# Altium project VNA_BASE_AF.PrjPcb
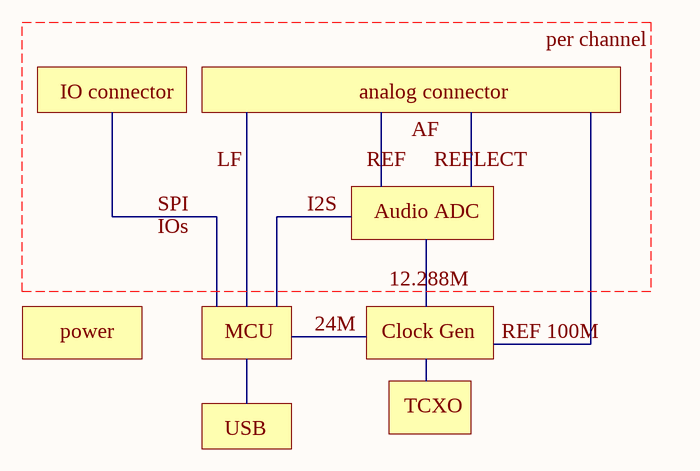
[diagram p0: block_diagram.SchDoc]
8 sheets, 89 parts. Net scope: flat (ports and power ports of the same name join across sheets).
Board file: VNA_BASE_AF.PcbDoc
Sheets:
  block_diagram.SchDoc
  AudioADCA.SchDoc
  AudioADCB.SchDoc
  clock.SchDoc
  MCU.SchDoc
  connectorA.SchDoc
  connectorB.SchDoc
  power.SchDoc

## Sheet block_diagram.SchDoc
size A4

### Notes on the sheet
- per channel
- IO connector
- LF
- analog connector
- REF
- AF
- REFLECT
- SPI
- IOs
- I2S
- Audio ADC
- 12.288M
- power
- MCU
- 24M
- Clock Gen
- REF 100M
- USB
- TCXO

## Sheet AudioADCA.SchDoc
size A4
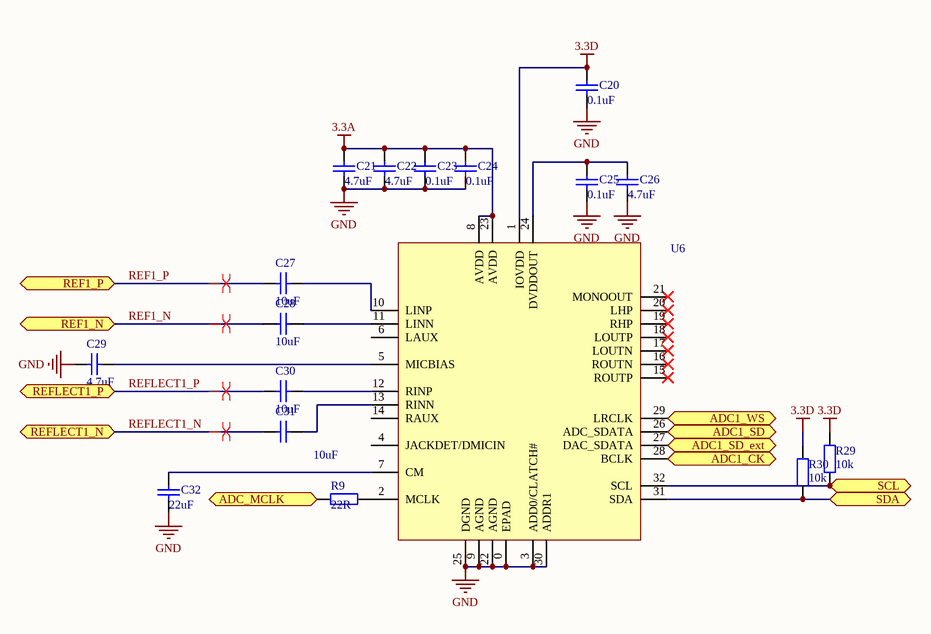
[diagram p1: AudioADCA.SchDoc]

### Parts
C20  0.1uF  [0402]
C21  4.7uF  [0805]
C22  4.7uF  [0805]
C23  0.1uF  [0402]
C24  0.1uF  [0402]
C25  0.1uF  [0402]
C26  4.7uF  [0805]
C27  10uF  [0402]
C28  10uF  [0402]
C29  4.7uF  [0402]
C30  10uF  [0402]
C31  10uF  [0402]
C32  22uF  [0805]
R9  22R  [0402]
R29  value 10k  [0402]  (hidden comment: Res2)
R30  value 10k  [0402]  (hidden comment: Res2)
U6  ADAU1761  [ADAU1761]  (value not drawn)

### Ports
ADC1_CK, ADC1_SD, ADC1_SD_ext, ADC1_WS, ADC_MCLK, REF1_N, REF1_P, REFLECT1_N, REFLECT1_P, SCL, SDA

### Nets
3.3A: C21.2 C22.2 C23.2 C24.2 U6.8(AVDD) U6.23(AVDD)
3.3D: C20.2 R29.2 R30.2 U6.1(IOVDD)
GND: C20.1 C21.1 C22.1 C23.1 C24.1 C25.1 C26.1 C29.1 C32.1 U6.0(EPAD) U6.3(ADD0/CLATCH#) U6.9(AGND) U6.22(AGND) U6.25(DGND) U6.30(ADDR1)
REF1_N: C28.2 ; port REF1_N
REF1_P: C27.2 ; port REF1_P
REFLECT1_N: C31.1 ; port REFLECT1_N
REFLECT1_P: C30.1 ; port REFLECT1_P
NetC25_2: C25.2 C26.2 U6.24(DVDDOUT)
NetC27_1: C27.1 U6.10(LINP)
NetC28_1: C28.1 U6.11(LINN)
NetC29_2: C29.2 U6.5(MICBIAS)
NetC30_2: C30.2 U6.12(RINP)
NetC31_2: C31.2 U6.13(RINN)
NetC32_2: C32.2 U6.7(CM)
NetR8_2: R9.2 ; port ADC_MCLK
NetR9_1: R9.1 U6.2(MCLK)
NetR11_2: R30.1 U6.31(SDA) ; port SDA
NetR12_2: R29.1 U6.32(SCL) ; port SCL
NetR16_1: U6.29(LRCLK) ; port ADC1_WS
NetR16_2: U6.28(BCLK) ; port ADC1_CK
NetR16_3: U6.27(DAC_SDATA) ; port ADC1_SD_ext
NetR16_4: U6.26(ADC_SDATA) ; port ADC1_SD

Not connected (* = marked no-connect by the designer): U6 4(JACKDET/DMICIN) 6(LAUX) 14(RAUX) 15(ROUTP)* 16(ROUTN)* 17(LOUTN)* 18(LOUTP)* 19(RHP)* 20(LHP)* 21(MONOOUT)*

### Layout directives
differential pair: REF1_N, REF1_P, REFLECT1_N, REFLECT1_P

### Library data of the parts
C20-C32 = Cap: Capacitor; Published: 8-Jun-2000; LatestRevisionDate: 17-Jul-2002; LatestRevisionNote: Re-released for DXP Platform.; PackageReference: RAD-0.3; Publisher: Altium Limited; PackageDescription: Radial Cap, Thru-Hole; 2 Leads; 0.3 in Pin Spacing
R9 R29 R30 = Res2: Resistor; Published: 8-Jun-2000; LatestRevisionDate: 17-Jul-2002; LatestRevisionNote: Re-released for DXP Platform.; PackageReference: AXIAL-0.4; Publisher: Altium Limited; PackageDescription: Axial Device, Thru-Hole; 2 Leads; 0.4 in Pin Spacing

## Sheet AudioADCB.SchDoc
size A4

## Sheet clock.SchDoc
size A4
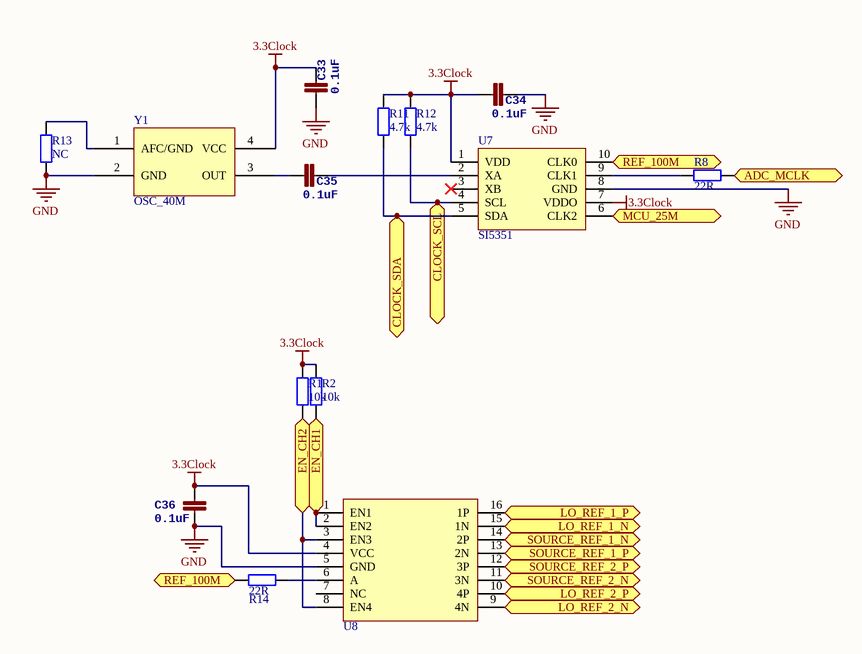
[diagram p2: clock.SchDoc]

### Parts
C33  0.1uF  [0402]
C34  0.1uF  [0402]
C35  0.1uF  [0402]
C36  0.1uF  [0402]
R1  10k  [0402]
R2  10k  [0402]
R8  22R  [0402]
R11  4.7k  [0402]
R12  4.7k  [0402]
R13  NC  [0402]
R14  22R  [0402]
U7  SI5351  [si5351]
U8  SN65LVDS105  [TSSOP16_44MM_065P - duplicate]  (value not drawn)
Y1  OSC_40M  [TXC_7Q]

### Ports
ADC_MCLK, CLOCK_SCL, CLOCK_SDA, EN_CH1, EN_CH2, LO_REF_1_N, LO_REF_1_P, LO_REF_2_N, LO_REF_2_P, MCU_25M, REF_100M, SOURCE_REF_1_N, SOURCE_REF_1_P, SOURCE_REF_2_N, SOURCE_REF_2_P

### Nets
3.3Clock: C33.2 C34.1 C36.2 R1.2 R2.2 R11.1 R12.1 U7.1(VDD) U7.7(VDDO) U8.4(VCC) Y1.4(VCC)
GND: C33.1 C34.2 C36.1 R13.2 U7.8(GND) U8.5(GND) Y1.2(GND)
NetC35_1: C35.1 Y1.3(OUT)
NetC35_2: C35.2 U7.2(XA)
NetC37_2: U7.6(CLK2) ; port MCU_25M
NetP2_3: U8.14(2P) ; port SOURCE_REF_1_N
NetP2_4: U8.13(2N) ; port SOURCE_REF_1_P
NetP2_6: U8.15(1N) ; port LO_REF_1_N
NetP2_7: U8.16(1P) ; port LO_REF_1_P
NetR1_1: R1.1 U8.3(EN3) U8.8(EN4) ; port EN_CH2
NetR2_1: R2.1 U8.1(EN1) U8.2(EN2) ; port EN_CH1
NetR8_1: R8.1 U7.9(CLK1)
NetR8_2: R8.2 ; port ADC_MCLK
NetR11_2: R11.2 U7.5(SDA) ; port CLOCK_SDA
NetR12_2: R12.2 U7.4(SCL) ; port CLOCK_SCL
NetR13_1: R13.1 Y1.1(AFC/GND)
NetR14_1: R14.1 U8.6(A)
NetR14_2: R14.2 U7.10(CLK0) ; port REF_100M
NetU8_9: U8.9(4N) ; port LO_REF_2_N
NetU8_10: U8.10(4P) ; port LO_REF_2_P
NetU8_11: U8.11(3N) ; port SOURCE_REF_2_N
NetU8_12: U8.12(3P) ; port SOURCE_REF_2_P

Not connected (* = marked no-connect by the designer): U7 3(XB)*; U8 7(NC)

### Library data of the parts
C33-C36 = CAP0402-CAP: <b>Capacitor</b> / Standard 0603 ceramic capacitor, and 0.1" leaded capacitor.; PARTNO: CC0402ZRY5V7BB104
R1 R2 R8 R11-R14 = Res2: Resistor; Published: 8-Jun-2000; LatestRevisionDate: 17-Jul-2002; LatestRevisionNote: Re-released for DXP Platform.; PackageReference: AXIAL-0.4; Publisher: Altium Limited; PackageDescription: Axial Device, Thru-Hole; 2 Leads; 0.4 in Pin Spacing

## Sheet MCU.SchDoc
size A4
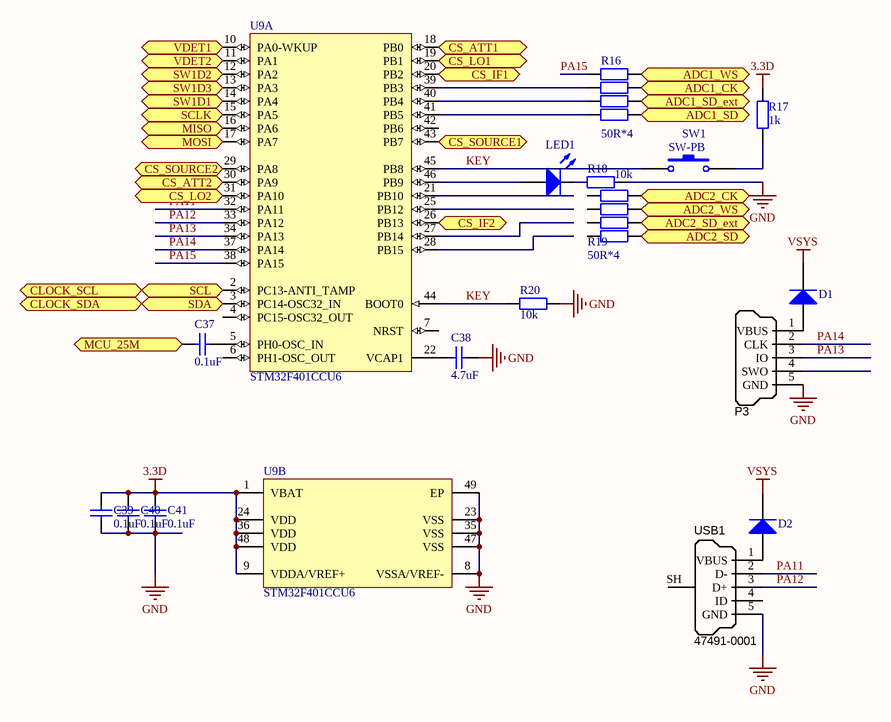
[diagram p3: MCU.SchDoc]

### Parts
C37  value 0.1uF  [0402]  (hidden comment: Cap)
C38  value 4.7uF  [0603L]  (hidden comment: Cap)
C39  value 0.1uF  [0402]  (hidden comment: Cap)
C40  value 0.1uF  [0402]  (hidden comment: Cap)
C41  value 0.1uF  [0402]  (hidden comment: Cap)
D1  (no value)  [LC-SOD-323]
D2  (no value)  [LC-SOD-323]
LED1  LED0  [0603]  (value not drawn)
P3  SWD_MicroUSB  [MICRO-YZX]  (value not drawn)
R16  50R*4  [0402X4]
R17  1k  [0402]
R18  10k  [0402]
R19  50R*4  [0402X4]
R20  value 10k  [0402]  (hidden comment: Res2)
SW1  SW-PB  [SW3x4]
U9  STM32F401CCU6  [STM-UFQFPN48_N]  (parts A,B of 2)
USB1  Manufacturer Part Number 1: 47491-0001  [MICRO-YZX]  (hidden comment: USB Micro Type B)

### Ports
ADC1_CK, ADC1_SD, ADC1_SD_ext, ADC1_WS, ADC2_CK, ADC2_SD, ADC2_SD_ext, ADC2_WS, CLOCK_SCL, CLOCK_SDA, CS_ATT1, CS_ATT2, CS_IF1, CS_IF2, CS_LO1, CS_LO2, CS_SOURCE1, CS_SOURCE2, MCU_25M, MISO, MOSI, SCL, SCLK, SDA, SW1D1, SW1D2, SW1D3, VDET1, VDET2

### Nets
3.3D: C39.2 C40.2 C41.2 R17.2 U9.1(VBAT) U9.9(VDDA/VREF+) U9.24(VDD) U9.36(VDD) U9.48(VDD)
GND: C38.1 C39.1 C40.1 C41.1 P3.5(GND) R18.2 R20.2 U9.8(VSSA/VREF-) U9.23(VSS) U9.35(VSS) U9.47(VSS) U9.49(EP) USB1.5(GND)
VSYS: D1.2(K) D2.2(K)
KEY: R20.1 SW1.1 U9.44(BOOT0) U9.45(PB8)
PA11: U9.32(PA11) USB1.2(D-)
PA12: U9.33(PA12) USB1.3(D+)
PA13: P3.3(IO) U9.34(PA13)
PA14: P3.2(CLK) U9.37(PA14)
PA15: R16.8 U9.38(PA15)
NetC37_1: C37.1 U9.5(PH0-OSC_IN)
NetC37_2: C37.2 ; port MCU_25M
NetC38_2: C38.2 U9.22(VCAP1)
NetD1_1: D1.1(A) P3.1(VBUS)
NetD2_1: D2.1(A) USB1.1(VBUS)
NetLED1_1: LED1.1(A) U9.46(PB9)
NetLED1_2: LED1.2(K) R18.1
NetR11_2: U9.3(PC14-OSC32_IN) ; port SDA, port CLOCK_SDA
NetR12_2: U9.2(PC13-ANTI_TAMP) ; port SCL, port CLOCK_SCL
NetR16_1: R16.1 ; port ADC1_WS
NetR16_2: R16.2 ; port ADC1_CK
NetR16_3: R16.3 ; port ADC1_SD_ext
NetR16_4: R16.4 ; port ADC1_SD
NetR16_5: R16.5 U9.41(PB5)
NetR16_6: R16.6 U9.40(PB4)
NetR16_7: R16.7 U9.39(PB3)
NetR17_1: R17.1 SW1.2
NetR19_1: R19.1 ; port ADC2_CK
NetR19_2: R19.2 ; port ADC2_WS
NetR19_3: R19.3 ; port ADC2_SD_ext
NetR19_4: R19.4 ; port ADC2_SD
NetR25_1: U9.10(PA0-WKUP) ; port VDET1
NetR37_13: U9.20(PB2) ; port CS_IF1
NetR37_14: U9.17(PA7) ; port MOSI
NetR37_15: U9.16(PA6) ; port MISO
NetR37_16: U9.15(PA5) ; port SCLK
NetR38_9: U9.19(PB1) ; port CS_LO1
NetR38_14: U9.18(PB0) ; port CS_ATT1
NetR39_1: U9.13(PA3) ; port SW1D3
NetR39_2: U9.12(PA2) ; port SW1D2
NetR39_3: U9.14(PA4) ; port SW1D1
NetR39_4: U9.43(PB7) ; port CS_SOURCE1
NetU9_11: U9.11(PA1) ; port VDET2
NetU9_26: U9.26(PB13) ; port CS_IF2
NetU9_29: U9.29(PA8) ; port CS_SOURCE2
NetU9_30: U9.30(PA9) ; port CS_ATT2
NetU9_31: U9.31(PA10) ; port CS_LO2

Not connected (* = marked no-connect by the designer): P3 4(SWO); R19 5 6 7 8; U9 4(PC15-OSC32_OUT) 6(PH1-OSC_OUT) 7(NRST) 21(PB10) 25(PB12) 27(PB14) 28(PB15) 42(PB6); USB1 4(ID) SH(Shell)

### Library data of the parts
C37-C41 = Cap: Capacitor; Published: 8-Jun-2000; LatestRevisionDate: 17-Jul-2002; LatestRevisionNote: Re-released for DXP Platform.; PackageReference: RAD-0.3; Publisher: Altium Limited; PackageDescription: Radial Cap, Thru-Hole; 2 Leads; 0.3 in Pin Spacing
D1 D2 = Diode 1N4148: High Conductance Fast Diode; Published: 8-Jun-2000; LatestRevisionDate: 17-Jul-2002; LatestRevisionNote: Re-released for DXP Platform.; DatasheetVersion: 1997; PackageReference: DO-35; Publisher: Altium Limited; PackageDescription: Diode, Axial; Body 3.8 x 1.9 mm (LxDia. max), Lead Dia. 0.53 mm (max); Code_JEDEC: DO-204-AH; ComponentLink1Description: Manufacturer Link; ComponentLink1URL: http://www.fairchildsemi.com/; ComponentLink2Description: Datasheet; ComponentLink2URL: http://www.fairchildsemi.com/ds/1N%2F1N4148.pdf
LED1 = LED0: Typical INFRARED GaAs LED; Published: 8-Jun-2000; LatestRevisionDate: 08-Jul-2005; LatestRevisionNote: Mech Layer 1 removed.; PackageReference: LED-0; Publisher: Altium Limited; PackageDescription: LED; 2 Leads
P3 = SWD_MicroUSB: Connector SMD USB Micro Type B middle mount; Manufacturer 1: Molex Inc; SCDType: undef; Package / Case: SMD; Supplier 1: Digi-Key; Supplier Part Number 1: WM17142CT-ND
R16 R19 = Res*4: Resistor; Published: 8-Jun-2000; LatestRevisionDate: 17-Jul-2002; LatestRevisionNote: Re-released for DXP Platform.; PackageReference: AXIAL-0.4; Publisher: Altium Limited; PackageDescription: Axial Device, Thru-Hole; 2 Leads; 0.4 in Pin Spacing
R17 R18 = Res2: Resistor; Value: 0Ohm; Published: 8-Jun-2000; LatestRevisionDate: 17-Jul-2002; LatestRevisionNote: Re-released for DXP Platform.; PackageReference: AXIAL-0.4; Publisher: Altium Limited; PackageDescription: Axial Device, Thru-Hole; 2 Leads; 0.4 in Pin Spacing
R20 = Res2: Resistor; Published: 8-Jun-2000; LatestRevisionDate: 17-Jul-2002; LatestRevisionNote: Re-released for DXP Platform.; PackageReference: AXIAL-0.4; Publisher: Altium Limited; PackageDescription: Axial Device, Thru-Hole; 2 Leads; 0.4 in Pin Spacing
SW1 = SW-PB: Switch; Published: 24-Mar-1999; LatestRevisionDate: 17-Jul-2002; LatestRevisionNote: Re-released for DXP Platform.; PackageReference: SPST-2; Publisher: Altium Limited; PackageDescription: Switch; 2 Leads
U9 = STM32F401CCU6: ARM Cortex-M4 32-bit MCU+FPU, 105 DMIPS, 256 kB Flash, 64 kB Internal RAM, 36 I/Os, 48-pin UFQFPN, -40 to 85 degC, Tray; Manufacturer: STMicroelectronics; FLASH Size (Prog) (kB): 256; I/Os (High Current): 36; Internal RAM Size (kB): 64; Operating Frequency(F) (Processor speed) (MHz): 84; Supply Voltage(Vcc) max (V): 3.6; Supply Voltage(Vcc) min (V): 1.8; DatasheetVersion: Rev. 1; PackageVersion: Rev. 1, 04/2013; PackageReference: UFQFPN48; PackageDescription: 48-Pin Ultra Thin Fine Pitch Quad Flat No-Lead, 7 x 7 x 0.6 mm Body, 0.5 mm Pitch, Exposed Pad; Supplier 1: Newark; Supplier Part Number 1: 19X6217; Supplier 2: Mouser; Supplier Part Number 2: 511-STM32F401CCU6; Core: ARM Cortex-M4; Packing: Tray; Mounting Technology: Surface Mount; PartNumber: STM32F401CCU6; ComponentLink1Description: Manufacturer URL; ComponentLink1URL: http://www.st.com/web/en/home.html; ComponentLink2Description: Datasheet; ComponentLink2URL: http://www.st.com/st-web-ui/static/active/en/resource/technical/document/data_brief/DM00071938.pdf; ComponentLink3Description: Package Specification; ComponentLink3URL: http://www.st.com/st-web-ui/static/active/en/resource/technical/document/data_brief/DM00071938.pdf
USB1 = USB_Micro_TypeB: Connector SMD USB Micro Type B middle mount; Manufacturer 1: Molex Inc; SCDType: undef; Package / Case: SMD; Supplier 1: Digi-Key; Supplier Part Number 1: WM17142CT-ND

## Sheet connectorA.SchDoc
size A4
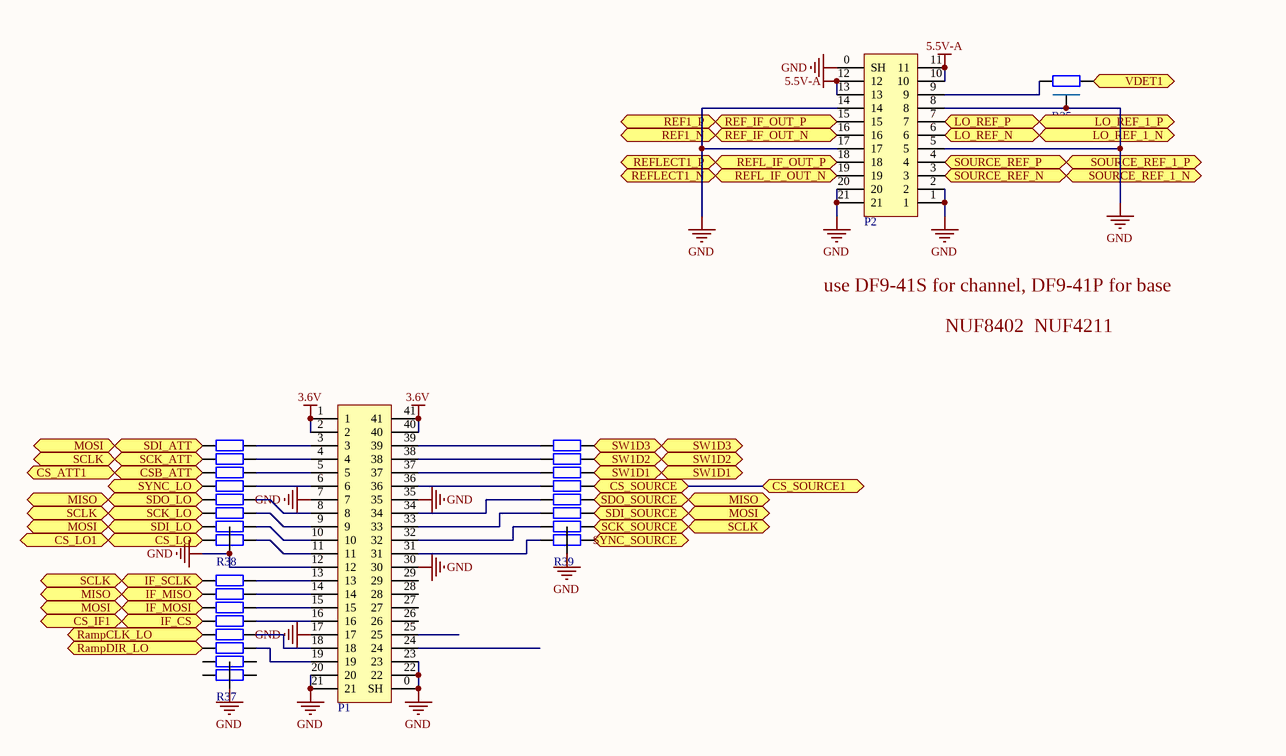
[diagram p4: connectorA.SchDoc]

### Parts
P1  DF9-41S  [VNA_CHANNEL]  (value not drawn)
P2  DF9-21  [DF9-21P]  (value not drawn)
R25  PiFilter  [PiFIiter]  (value not drawn)
R37  NUF8xxx  [NUF8xxx]  (value not drawn)
R38  NUF8xxx  [NUF8xxx]  (value not drawn)
R39  NUF8xxx  [NUF8xxx]  (value not drawn)

### Ports
CS_ATT1, CS_IF1, CS_LO, CS_LO1, CS_SOURCE, CS_SOURCE1, CSB_ATT, IF_CS, IF_MISO, IF_MOSI, IF_SCLK, LO_REF_1_N, LO_REF_1_P, LO_REF_N, LO_REF_P, MISO, MOSI, RampCLK_LO, RampDIR_LO, REF1_N, REF1_P, REF_IF_OUT_N, REF_IF_OUT_P, REFL_IF_OUT_N, REFL_IF_OUT_P, REFLECT1_N, REFLECT1_P, SCK_ATT, SCK_LO, SCK_SOURCE, SCLK, SDI_ATT, SDI_LO, SDI_SOURCE, SDO_LO, SDO_SOURCE, SOURCE_REF_1_N, SOURCE_REF_1_P, SOURCE_REF_N, SOURCE_REF_P, SW1D1, SW1D2, SW1D3, SYNC_LO, SYNC_SOURCE, VDET1

### Nets
3.6V: P1.1 P1.2 P1.40 P1.41
5.5V-A: P2.10 P2.11 P2.12 P2.13
GND: P1.0(SH) P1.7 P1.12 P1.17 P1.20 P1.21 P1.22 P1.23 P1.30 P1.35 P2.0(SH) P2.1 P2.2 P2.5 P2.8 P2.14 P2.17 P2.20 P2.21 R25.3 R37.0 R38.0 R39.0
REF1_N: P2.16 ; port REF_IF_OUT_N, port REF1_N
REF1_P: P2.15 ; port REF_IF_OUT_P, port REF1_P
REFLECT1_N: P2.19 ; port REFL_IF_OUT_N, port REFLECT1_N
REFLECT1_P: P2.18 ; port REFL_IF_OUT_P, port REFLECT1_P
NetP1_3: P1.3 R38.1
NetP1_4: P1.4 R38.2
NetP1_5: P1.5 R38.3
NetP1_6: P1.6 R38.4
NetP1_8: P1.8 R38.5
NetP1_9: P1.9 R38.6
NetP1_10: P1.10 R38.7
NetP1_11: P1.11 R38.8
NetP1_13: P1.13 R37.1
NetP1_14: P1.14 R37.2
NetP1_15: P1.15 R37.3
NetP1_16: P1.16 R37.4
NetP1_18: P1.18 R37.5
NetP1_19: P1.19 R37.6
NetP1_31: P1.31 R39.9
NetP1_32: P1.32 R39.10
NetP1_33: P1.33 R39.11
NetP1_34: P1.34 R39.12
NetP1_36: P1.36 R39.13
NetP1_37: P1.37 R39.14
NetP1_38: P1.38 R39.15
NetP1_39: P1.39 R39.16
NetP2_3: P2.3 ; port SOURCE_REF_N, port SOURCE_REF_1_N
NetP2_4: P2.4 ; port SOURCE_REF_P, port SOURCE_REF_1_P
NetP2_6: P2.6 ; port LO_REF_N, port LO_REF_1_N
NetP2_7: P2.7 ; port LO_REF_P, port LO_REF_1_P
NetP2_9: P2.9 R25.2
NetR25_1: R25.1 ; port VDET1
NetR37_11: R37.11 ; port RampDIR_LO
NetR37_12: R37.12 ; port RampCLK_LO
NetR37_13: R37.13 ; port IF_CS, port CS_IF1
NetR37_14: R37.14 R38.10 R38.16 R39.6 ; port SDI_SOURCE, port SDI_ATT, port SDI_LO, port IF_MOSI, port MOSI
NetR37_15: R37.15 R38.12 R39.5 ; port SDO_SOURCE, port SDO_LO, port IF_MISO, port MISO
NetR37_16: R37.16 R38.11 R38.15 R39.7 ; port SCK_SOURCE, port SCK_ATT, port SCK_LO, port IF_SCLK, port SCLK
NetR38_9: R38.9 ; port CS_LO, port CS_LO1
NetR38_13: R38.13 ; port SYNC_LO
NetR38_14: R38.14 ; port CSB_ATT, port CS_ATT1
NetR39_1: R39.1 ; port SW1D3
NetR39_2: R39.2 ; port SW1D2
NetR39_3: R39.3 ; port SW1D1
NetR39_4: R39.4 ; port CS_SOURCE, port CS_SOURCE1
NetR39_8: R39.8 ; port SYNC_SOURCE

Not connected (* = marked no-connect by the designer): P1 24 25 26 27 28 29; R37 7 8 9 10

### Notes on the sheet
- use DF9-41S for channel, DF9-41P for base
- NUF8402  NUF4211

## Sheet connectorB.SchDoc
size A4

## Sheet power.SchDoc
size A4
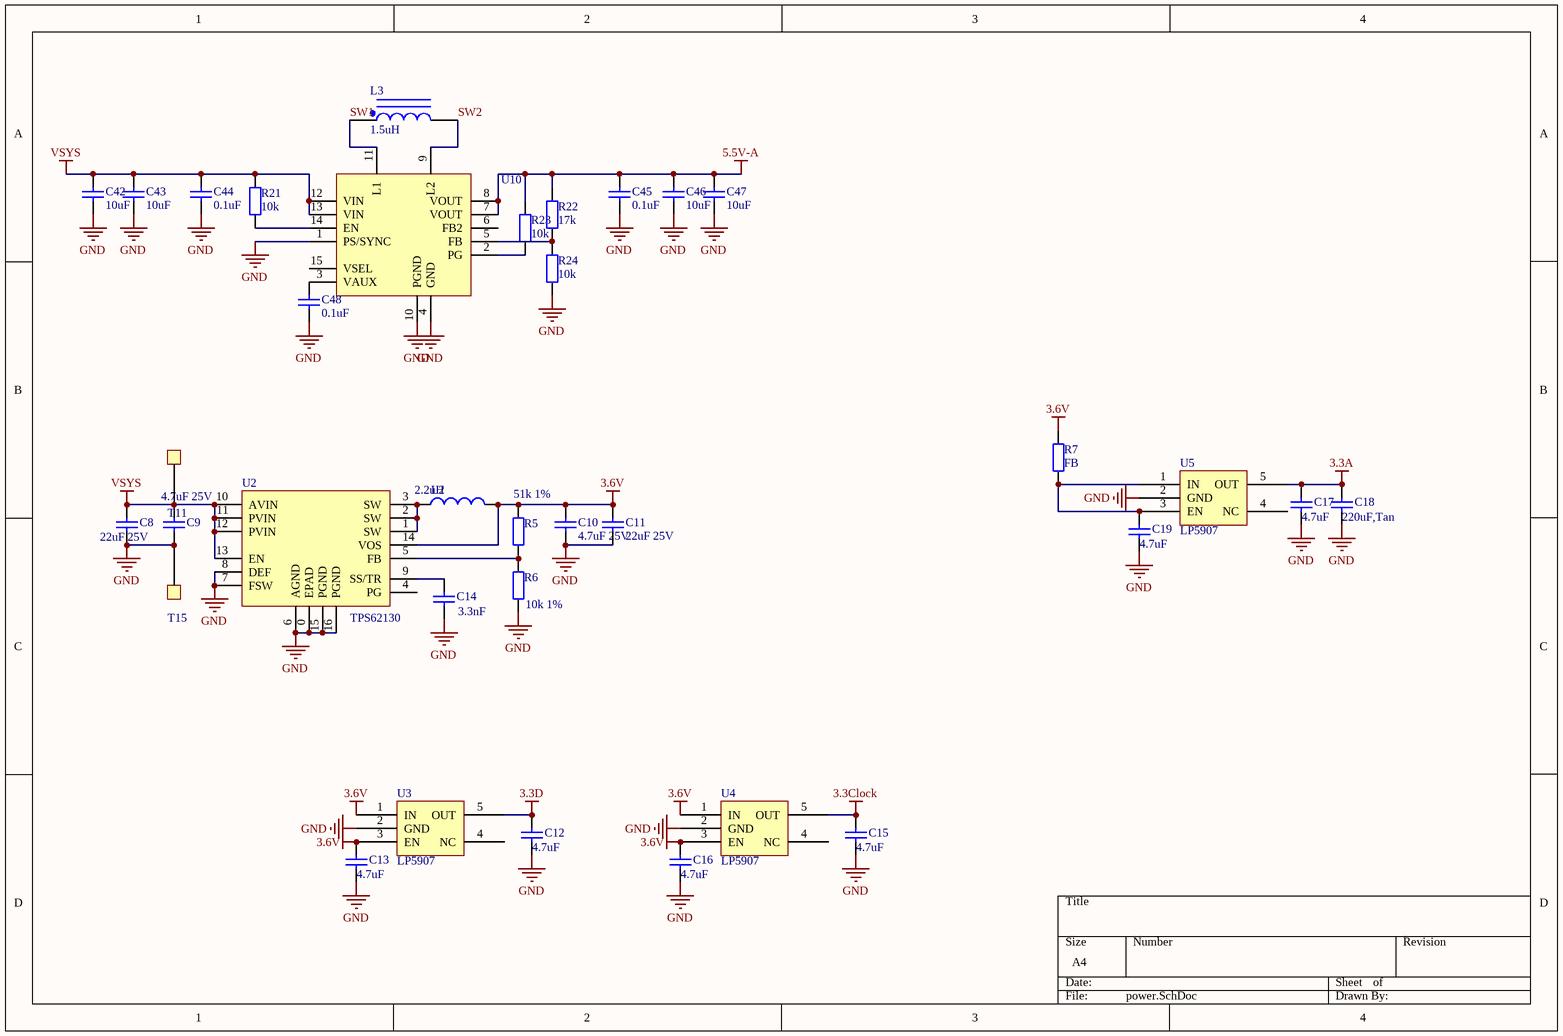
[diagram p5: power.SchDoc]

### Parts
C8  value 22uF 25V  [0805]  (hidden comment: Cap)
C9  value 4.7uF 25V  [0603]  (hidden comment: Cap)
C10  value 4.7uF 25V  [0603]  (hidden comment: Cap)
C11  value 22uF 25V  [0805]  (hidden comment: Cap)
C12  4.7uF  [0603L]
C13  4.7uF  [0603L]
C14  3.3nF  [0402]
C15  4.7uF  [0603L]
C16  4.7uF  [0603L]
C17  4.7uF  [0603L]
C18  220uF,Tan  [1210]
C19  4.7uF  [0603L]
C42  10uF  [0805]
C43  10uF  [0805]
C44  0.1uF  [0603L]
C45  0.1uF  [0603L]
C46  10uF  [0805]
C47  10uF  [0805]
C48  0.1uF  [0402]
L2  2.2uH  [L4015]
L3  1.5uH  [L4015]
R5  51k 1%  [0402]
R6  10k 1%  [0402]
R7  FB  [0603L]
R21  10k  [0402]
R22  17k  [0402]
R23  10k  [0402]
R24  10k  [0402]
T11  TestPad  [TestPad]  (value not drawn)
T15  TestPad  [TestPad]  (value not drawn)
U2  TPS62130  [TPS62130]
U3  LP5907  [SOT23-5]
U4  LP5907  [SOT23-5]
U5  LP5907  [SOT23-5]
U10  tps63070  [TPS63070]  (value not drawn)

### Nets
3.3A: C17.2 C18.2 U5.5(OUT)
3.3Clock: C15.2 U4.5(OUT)
3.3D: C12.2 U3.5(OUT)
3.6V: C10.2 C11.2 C13.2 C16.2 L2.2 R5.1 R7.2 U2.14(VOS) U3.1(IN) U3.3(EN) U4.1(IN) U4.3(EN)
5.5V-A: C45.2 C46.2 C47.2 R22.2 R23.2 U10.7(VOUT) U10.8(VOUT)
GND: C8.2 C9.2 C10.1 C11.1 C12.1 C13.1 C14.2 C15.1 C16.1 C17.1 C18.1 C19.1 C42.1 C43.1 C44.1 C45.1 C46.1 C47.1 C48.2 R6.2 R24.1 T15.1 U2.0(EPAD) U2.6(AGND) U2.7(FSW) U2.8(DEF) U2.15(PGND) U2.16(PGND) U3.2(GND) U4.2(GND) U5.2(GND) U10.1(PS/SYNC) U10.4(GND) U10.10(PGND)
VSYS: C8.1 C9.1 C42.2 C43.2 C44.2 R21.2 T11.1 U2.10(AVIN) U2.11(PVIN) U2.12(PVIN) U2.13(EN) U10.12(VIN) U10.13(VIN)
SW1: L3.1 U10.11(L1)
SW2: L3.2 U10.9(L2)
NetC14_1: C14.1 U2.9(SS/TR)
NetC19_2: C19.2 R7.1 U5.1(IN) U5.3(EN)
NetC48_1: C48.1 U10.3(VAUX)
NetL2_1: L2.1 U2.1(SW) U2.2(SW) U2.3(SW)
NetR5_2: R5.2 R6.1 U2.5(FB)
NetR21_1: R21.1 U10.14(EN)
NetR22_1: R22.1 R24.2 U10.5(FB)
NetR23_1: R23.1 U10.2(PG)

Not connected (* = marked no-connect by the designer): U2 4(PG); U3 4(NC); U4 4(NC); U5 4(NC); U10 6(FB2) 15(VSEL)

### Library data of the parts
C8-C19 C42-C48 = Cap: Capacitor; Published: 8-Jun-2000; LatestRevisionDate: 17-Jul-2002; LatestRevisionNote: Re-released for DXP Platform.; PackageReference: RAD-0.3; Publisher: Altium Limited; PackageDescription: Radial Cap, Thru-Hole; 2 Leads; 0.3 in Pin Spacing
L2 = Inductor: Code_IEC: 1005; Published: 8-Jun-2000; LatestRevisionDate: 29-May-2009; LatestRevisionNote: IPC-7351 Footprint Added.; PackageReference: 0402-A; Publisher: Altium Limited; PackageDescription: Chip Inductor; Code_JEITA: 0402
L3 = Inductor Iron Dot: Magnetic-Core Inductor with Winding Polarity Marking; Published: 24-Mar-1999; LatestRevisionDate: 17-Jul-2002; LatestRevisionNote: Re-released for DXP Platform.; PackageReference: DIODE_SMC; Publisher: Altium Limited; PackageDescription: Diode; 2 Leads
R5 R6 R21-R24 = Res2: Resistor; Published: 8-Jun-2000; LatestRevisionDate: 17-Jul-2002; LatestRevisionNote: Re-released for DXP Platform.; PackageReference: AXIAL-0.4; Publisher: Altium Limited; PackageDescription: Axial Device, Thru-Hole; 2 Leads; 0.4 in Pin Spacing
R7 = Res2: Resistor; Value: 0Ohm; Published: 8-Jun-2000; LatestRevisionDate: 17-Jul-2002; LatestRevisionNote: Re-released for DXP Platform.; PackageReference: AXIAL-0.4; Publisher: Altium Limited; PackageDescription: Axial Device, Thru-Hole; 2 Leads; 0.4 in Pin Spacing

## Nets that join several sheets
3.3A: AudioADCA (6 pins), power (C17.2 C18.2 U5.5)
3.3Clock: clock (11 pins), power (C15.2 U4.5)
3.3D: AudioADCA (C20.2 R29.2 R30.2 U6.1), MCU (9 pins), power (C12.2 U3.5)
3.6V: connectorA (P1.1 P1.2 P1.40 P1.41), power (12 pins)
5.5V-A: connectorA (P2.10 P2.11 P2.12 P2.13), power (7 pins)
GND: AudioADCA (15 pins), clock (7 pins), MCU (13 pins), connectorA (23 pins), power (34 pins)
VSYS: MCU (D1.2 D2.2), power (13 pins)
NetC37_2: clock (U7.6), MCU (C37.2)
NetP2_3: clock (U8.14), connectorA (P2.3)
NetP2_4: clock (U8.13), connectorA (P2.4)
NetP2_6: clock (U8.15), connectorA (P2.6)
NetP2_7: clock (U8.16), connectorA (P2.7)
NetR8_2: AudioADCA (R9.2), clock (R8.2)
NetR11_2: AudioADCA (R30.1 U6.31), clock (R11.2 U7.5), MCU (U9.3)
NetR12_2: AudioADCA (R29.1 U6.32), clock (R12.2 U7.4), MCU (U9.2)
NetR16_1: AudioADCA (U6.29), MCU (R16.1)
NetR16_2: AudioADCA (U6.28), MCU (R16.2)
NetR16_3: AudioADCA (U6.27), MCU (R16.3)
NetR16_4: AudioADCA (U6.26), MCU (R16.4)
NetR25_1: MCU (U9.10), connectorA (R25.1)
NetR37_13: MCU (U9.20), connectorA (R37.13)
NetR37_14: MCU (U9.17), connectorA (R37.14 R38.10 R38.16 R39.6)
NetR37_15: MCU (U9.16), connectorA (R37.15 R38.12 R39.5)
NetR37_16: MCU (U9.15), connectorA (R37.16 R38.11 R38.15 R39.7)
NetR38_9: MCU (U9.19), connectorA (R38.9)
NetR38_14: MCU (U9.18), connectorA (R38.14)
NetR39_1: MCU (U9.13), connectorA (R39.1)
NetR39_2: MCU (U9.12), connectorA (R39.2)
NetR39_3: MCU (U9.14), connectorA (R39.3)
NetR39_4: MCU (U9.43), connectorA (R39.4)
REF1_N: AudioADCA (C28.2), connectorA (P2.16)
REF1_P: AudioADCA (C27.2), connectorA (P2.15)
REFLECT1_N: AudioADCA (C31.1), connectorA (P2.19)
REFLECT1_P: AudioADCA (C30.1), connectorA (P2.18)